# EAGLE schematic RS233_BRD_single (EAGLE 7.6.0)
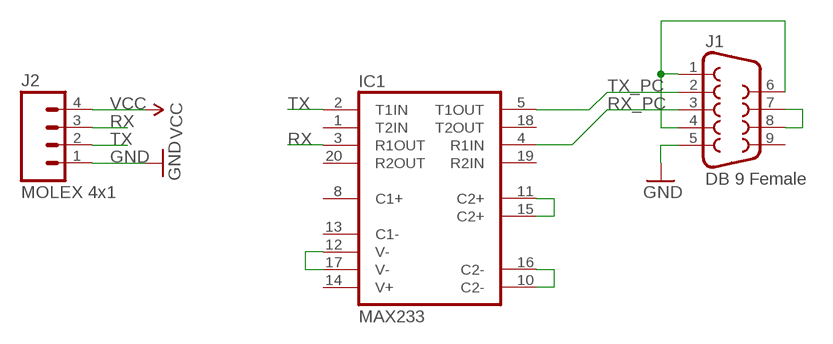
[diagram p0: schematic, sheet 1]

## Parts
IC1  MAX233  [DIL20]
J1  DB 9 Female  DB9FEMALE  [DB9]
J2  MOLEX 4x1  M04POLAR  [MOLEX-1X4]

## Nets
GND: J1.5 J2.1
N$1: IC1.11(C2+) IC1.15(C2+)
N$2: IC1.10(C2-) IC1.16(C2-)
N$3: J1.7 J1.8
N$4: J1.1 J1.4 J1.6
N$5: IC1.12(V-) IC1.17(V-)
RX: IC1.3(R1OUT) J2.3
RX_PC: IC1.4(R1IN) J1.3
TX: IC1.2(T1IN) J2.2
TX_PC: IC1.5(T1OUT) J1.2
VCC: J2.4
Unconnected: IC1.1(T2IN) IC1.8(C1+) IC1.13(C1-) IC1.14(V+) IC1.18(T2OUT) IC1.19(R2IN) IC1.20(R2OUT) J1.9

## Power pins joined to a net without a drawn wire
GND: IC1.6(GND) IC1.9(GND)
VCC: IC1.7(VCC)

## Library data of the parts
IC1 = maxim:MAX233: RS232 TRANSCEIVER; MPN: MAX233ACPP+G36; OC_FARNELL: 1593332; OC_NEWARK: 89K3459
J1 = SparkFun-Connectors:DB9: DB9 Connector Standard DB9 (D-Sub 9) serial connector. Can be used for CAN bus as well as RS485 and RS232. Footprint production proven. Spark Fun Electronics SKU : PRT-00429; PROD_ID: CONN-08194
J2 = SparkFun-Connectors:M04: Header 4 Standard 4-pin 0.1" header. Use with straight break away headers (SKU : PRT-00116), right angle break away headers (PRT-00553), swiss pins (PRT-00743), machine pins (PRT-00117), and female headers (PRT-00115). Molex polarized connector foot print use with SKU : PRT-08231 with associated crimp pins and housings. 1MM SMD Version SKU: PRT-10208